# EAGLE schematic part 1 (EAGLE 8.2.2)
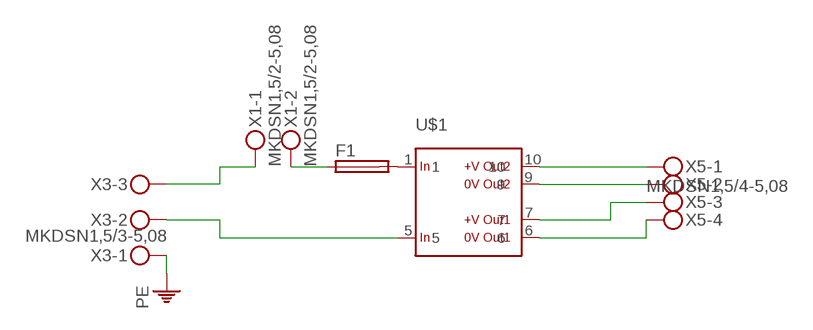
[diagram p0: schematic, sheet 1]

## Parts
F1  SH22,5A  [SH22,5A]
U$1  DOUBLE_ISO  [2ISO]
X1  MKDSN1,5/2-5,08  [MKDSN1,5/2-5,08]
X3  MKDSN1,5/3-5,08  [MKDSN1,5/3-5,08]
X5  MKDSN1,5/4-5,08  [MKDSN1,5/4-5,08]

## Nets
N$1: U$1.6 X5.4
N$2: F1.1 X1.2
N$3: U$1.7 X5.3
N$4: F1.2 U$1.1
N$5: U$1.9 X5.2
N$6: X1.1 X3.3
N$7: U$1.10 X5.1
N$10: U$1.5 X3.2
PE: X3.1

## Library data of the parts
F1 = fuse:SH22,5A: FUSE HOLDER grid 22,5mm, isolated cap OGN0031 8201, Schurter (Buerklin); MPN: 0031.7701.11; OC_FARNELL: unknown; OC_NEWARK: 04F1224
U$1 = myrra:DOUBLE_ISO: Two isolated Outputs Input voltage range: 85 to 265 V AC or 85 to 370 V DC Input frequency: 47 to 440 Hz Output voltage accuracy: see table for 10 to 100% rated load of each output (includes line and load variations) Operating ambient temperature: - 25°C / + Ta (see table) No load input power < 200mW regulated: Output 1 Output 1 Power Output 1 Efficiency Ta Reference Output 2 Output 2 (max W) Output 2 (%) (°C) (DC Volts) (DC mA) accuracy 47252 5 350 (600max) 3.5 ±3% 66 +60 5 350 max ±15% 47254 12 165 (300max) 4 ±5% 72 +60 12 165 max ±15% 47255 15 135 (200max) 4 ±5% 73 +60 15 135 max ±15% 47257 5 400 (600max) 4 ±3% 68 +60 12 170 max ±15% 47258 18 150 (200max) 4 ±5% 72 +60 8 150 max ±15% Source: http://www.myrra.com
X1 = con-phoenix-508:MKDSN1,5/2-5,08: MKDSN 1,5/ 2-5,08 Printklemme Nennstrom: 13,5 A Nennspannung: 250 V Rastermaß: 5,08 mm Polzahl: 2 Anschlussart: Schraubanschluss Montage: Löten Anschlussrichtung Leiter/Platine: 0 ° Artikelnummer: 1729128 Source: http://eshop.phoenixcontact.com .. 1729128.pdf
X3 = con-phoenix-508:MKDSN1,5/3-5,08: MKDSN 1,5/ 3-5,08 Printklemme Nennstrom: 13,5 A Nennspannung: 250 V Rastermaß: 5,08 mm Polzahl: 3 Anschlussart: Schraubanschluss Montage: Löten Anschlussrichtung Leiter/Platine: 0 ° Artikelnummer: 1729131 Source: http://eshop.phoenixcontact.com .. 1729131.pdf
X5 = con-phoenix-508:MKDSN1,5/4-5,08: MKDSN 1,5/ 4-5,08 Printklemme Nennstrom: 13,5 A Nennspannung: 250 V Rastermaß: 5,08 mm Polzahl: 4 Anschlussart: Schraubanschluss Montage: Löten Anschlussrichtung Leiter/Platine: 0 ° Artikelnummer: 1729144 Source: http://eshop.phoenixcontact.com .. 1729144.pdf